# EasyEDA Pro project 宠物喂食机-V2.eprj

# Schematic Schematic1
Create Date: 2023-04-19; Page Name: P1; Project Name: 宠物喂食机-V2; Schematic Name: Schematic1; Update Date: 2023-05-22; Company: 嘉立创EDA; Page Size: A4; Version: V1.0
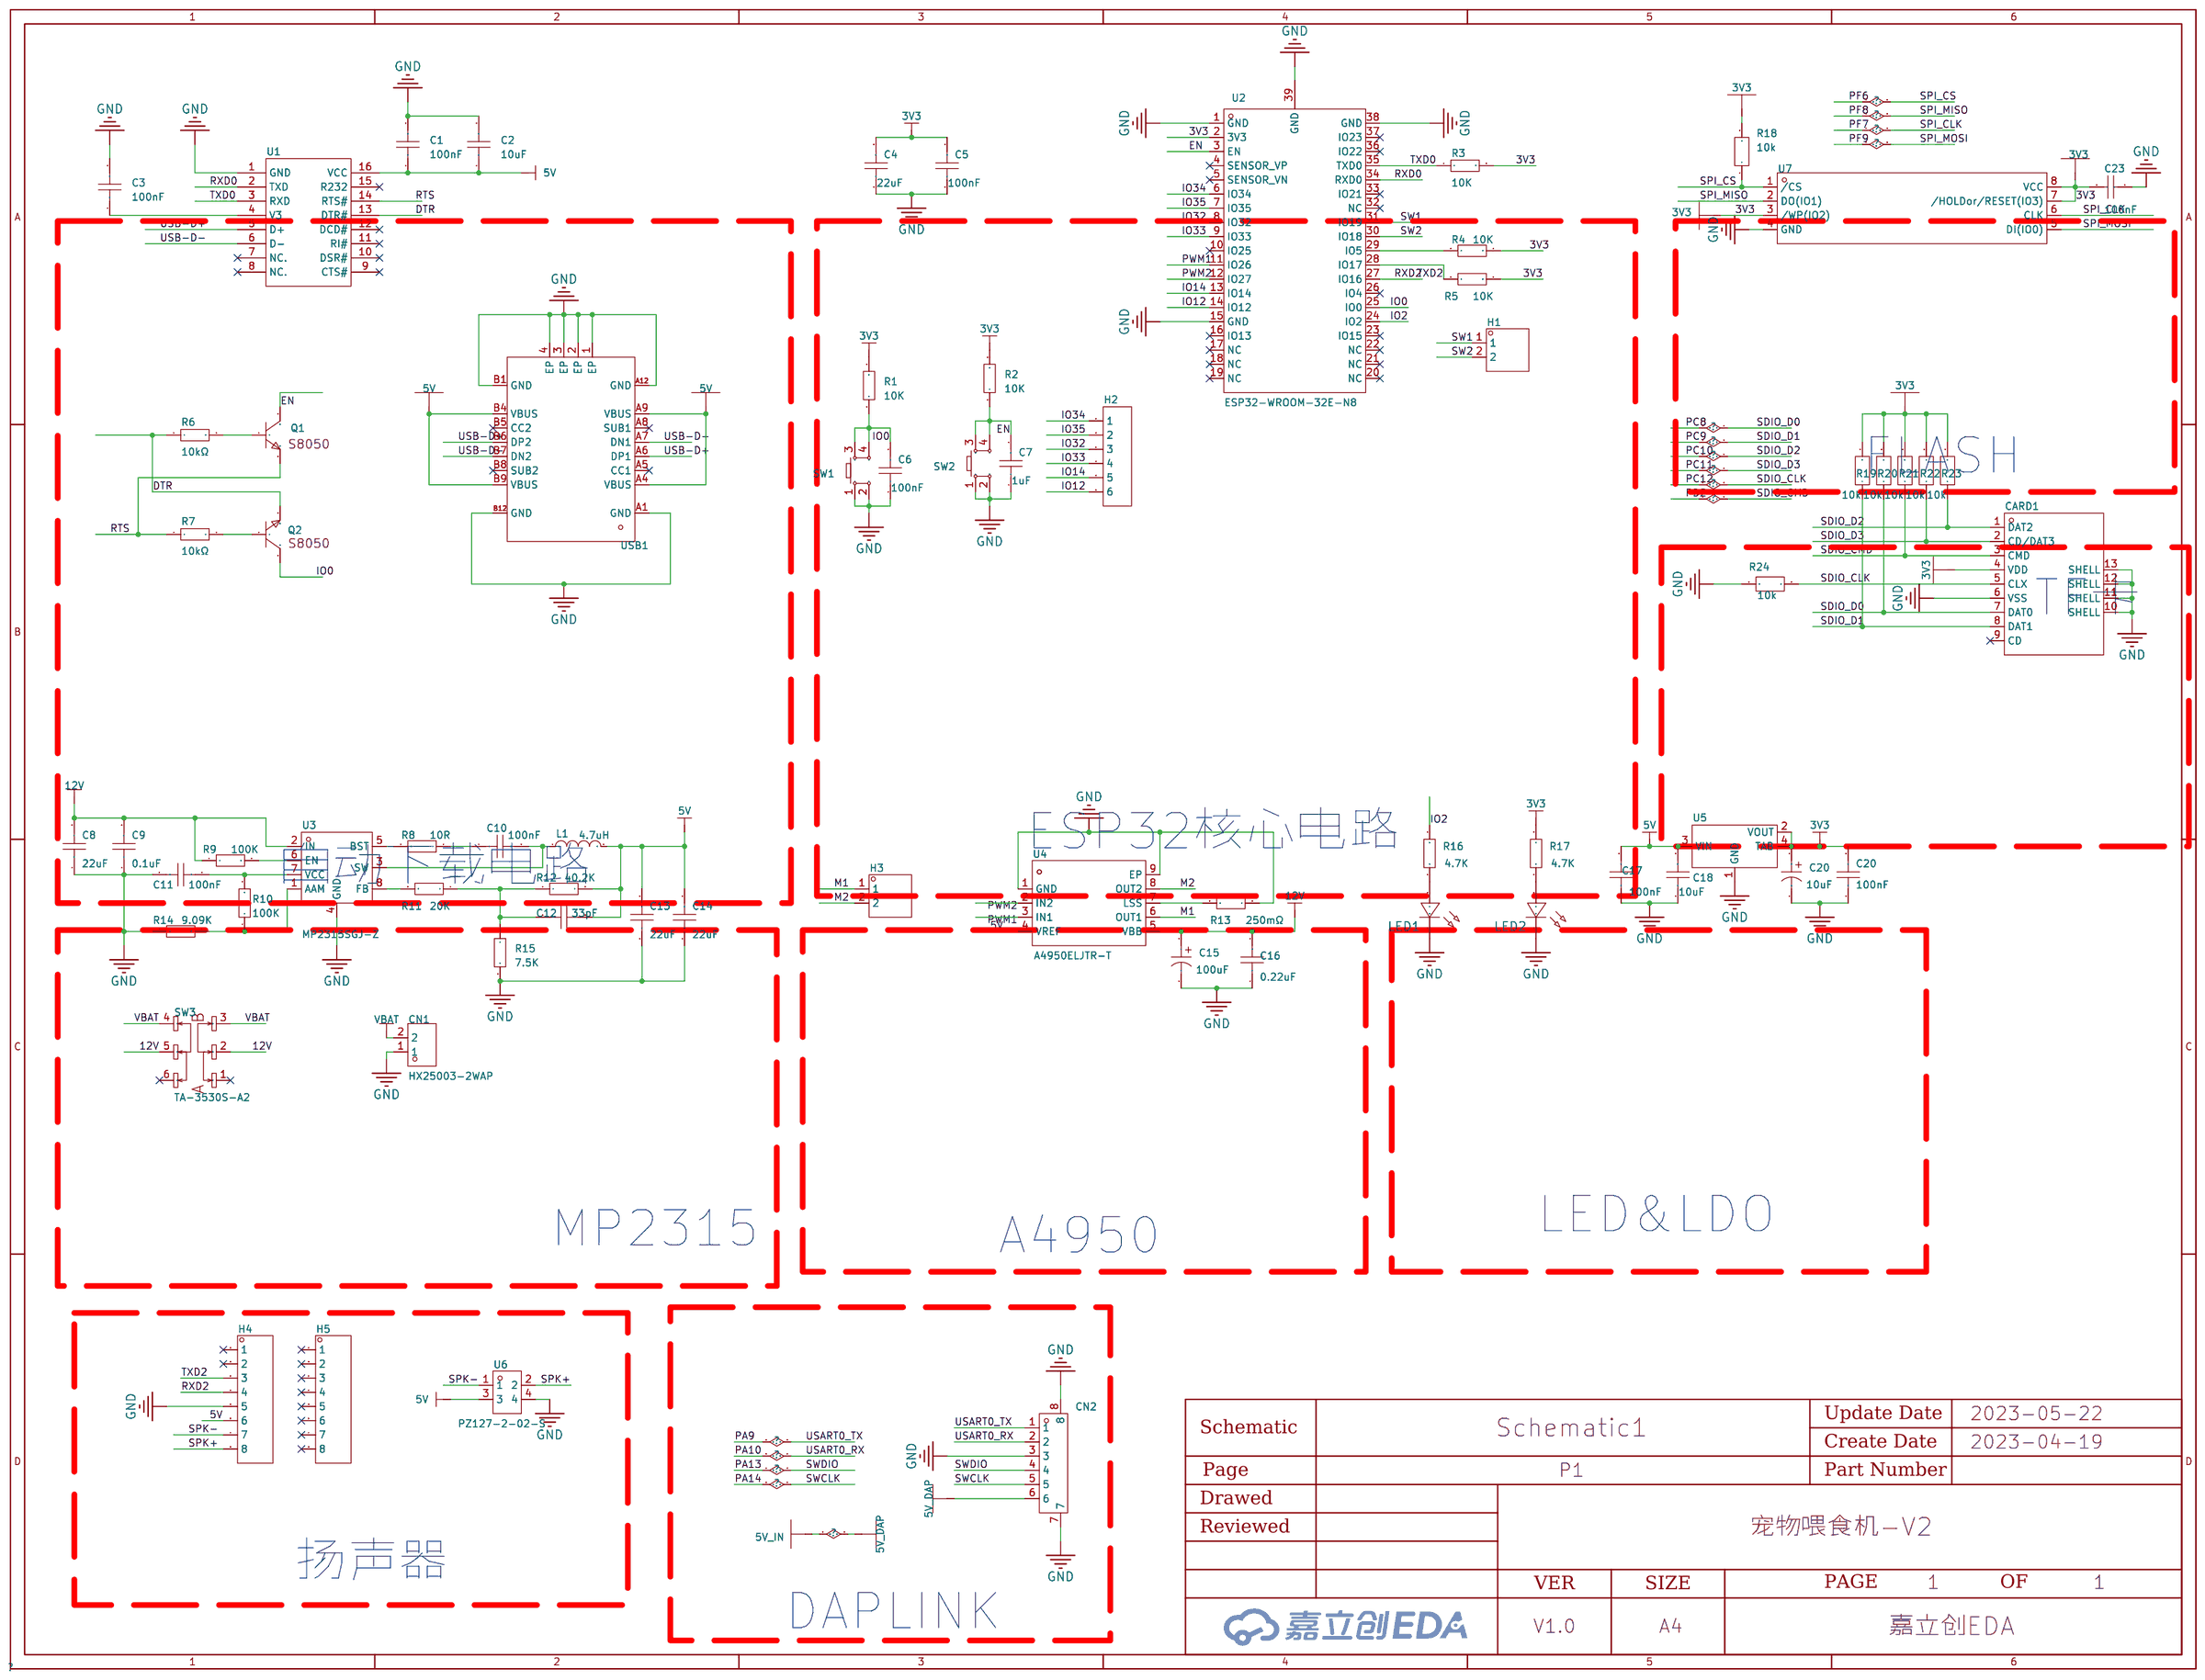
[diagram p0: schematic sheet]

## Parts
C1  100nF  [C0603]
C2  10uF  [C0603]
C3  100nF  [C0603]
C4  22uF  [C0603]
C5  100nF  [C0603]
C6  100nF  [C0603]
C7  1uF  [C0603]
C8  22uF  [C1206]
C9  0.1uF  [C0805]
C10  100nF  [C0603]
C11  100nF  [C0603]
C12  33pF  [C0603]
C13  22uF  [C0805]
C14  22uF  [C0805]
C15  100uF  [CAP-SMD_BD8.0-L8.3-W8.3-FD]
C16  0.22uF  [C0603_2]
C17  100nF  [C0603_1]
C18  10uF  [C0603_1]
C20  100nF  [C0603_1]
C20#2  10uF  [CAP-SMD_L3.2-W1.6-FD]
C23  100nF  [r0402_1]
CARD1  -  [tf-smd_thd2528-11sd-gf_1]
CN1  HX25003-2WAP  [CONN-TH_2P-P2.50_HX25003-2WAP]
CN2  -  [CONN-SMD_6P-P1.00_XUNPU_WAFER-100W-6P]
H1  -  [HDR-TH_2P-P2.54-V-M-1]
H2  -  [HDR-TH_6P-P2.54-V-M-1]
H3  -  [HDR-TH_2P-P2.54-V-M-1]
H4  -  [HDR-TH_8P-P2.54-V-M]
H5  -  [HDR-TH_8P-P2.54-V-M]
L1  4.7uH  [IND-SMD_L7.3-W6.6]
LED1  -  [LED_0603]
LED2  -  [LED_0603]
Q1  -  [S8050_SOT-23]
Q2  -  [S8050_SOT-23]
R1  10K  [R0603]
R2  10K  [R0603]
R3  10K  [R0603_1]
R4  10K  [R0603]
R5  10K  [R0603_1]
R6  10kΩ  [R0603]
R7  10kΩ  [R0603]
R8  10R  [R0603]
R9  100K  [R0603]
R10  100K  [R0603]
R11  20K  [R0603]
R12  40.2K  [R0603]
R13  250mΩ  [R2512]
R14  9.09K  [R0603]
R15  7.5K  [R0603]
R16  4.7K  [R0603]
R17  4.7K  [R0603]
R18  10k  [R0402]
R19  10k  [R0402]
R20  10k  [R0402]
R21  10k  [R0402]
R22  10k  [R0402]
R23  10k  [R0402]
R24  10k  [R0402]
SW1  -  [KEY-SMD_4P-L4.5-W4.5-P3.00-LS6.8]
SW2  -  [KEY-SMD_4P-L4.5-W4.5-P3.00-LS6.8]
SW3  TA-3530S-A2  [SW-SMD_6P-L9.1-W3.5-P2.50-LS6.9]
U1  CH340C  [SOP-16_L10.0-W3.9-P1.27-LS6.0-BL]
U2  ESP32-WROOM-32E-N8  [WIFI-SMD_ESP32-WROOM-32E_1]
U3  MP2315SGJ-Z  [TSOT-23-8_L2.9-W1.6-P0.65-LS2.8-BL]
U4  A4950ELJTR-T  [SOIC-8_L4.9-W3.9-P1.27-LS6.0-BL-EP]
U5  -  [SOT_224]
U6  PZ127-2-02-S  [HDR-SMD_4P-P1.27-V-M-R2-C2-LS5.3]
U7  -  [SOIC-8_L5.2-W5.2-P1.27-LS7.9-BL]
USB1  -  [USB-C-SMD_KH-TYPE-C-16P_1]

## Library data of the parts
C1-C7 = CAP_0805: Supplier Footprint: 0805
C8 = CAP_1206: Supplier Footprint: 1206
C9 C10 C12-C14 = CAP_0603: Supplier Footprint: 0603
C11 = CL05B104KO5NNNC: 容值:100nF;精度:±10%;额定电压:16V;材质(温度系数):X7R;; LCSC Part Name: 100nF ±10% 16V; Supplier Part: C1525; Manufacturer: SAMSUNG(三星); Supplier Footprint: 0402; JLCPCB Part Class: Basic Part; Datasheet: https://atta.szlcsc.com/upload/public/pdf/source/20160103/1457707674891.pdf; Supplier: LCSC; Tolerance: ±10%; Voltage Rated: 16V; Temperature Coefficient: X7R
C15 = 50SGV100M8X10.5: 容值:100uF;额定电压:50V;纹波电流:-;等效串联电阻:-;; LCSC Part Name: 100uF 50V; Supplier Part: C700843; Manufacturer: rubycon(红宝石); Supplier Footprint: SMD,D8xL10.5mm; JLCPCB Part Class: Extended Part; Datasheet: https://atta.szlcsc.com/upload/public/pdf/source/20200710/C700843_0FD27FFFAAC5BA0F9ED055A6AD937E84.pdf; Supplier: LCSC; Rated Voltage: 50V
C16 = CAP_605: Supplier Footprint: 0603
C17 C18 C20 = CAP_604: Supplier Footprint: 0603; Check: true
C20#2 = T494A106K016AT: 容值:10uF;精度:±10%;额定电压:16V;等效串联电阻:3Ω;; LCSC Part Name: 10uF ±10% 16V; Supplier Part: C1952724; Manufacturer: KEMET(基美); Supplier Footprint: 1206; JLCPCB Part Class: Extended Part; Datasheet: https://atta.szlcsc.com/upload/public/pdf/source/20201117/C918865_2EC2324DB0DED54D3EF2ACC81798626D.pdf; Supplier: LCSC; Tolerance: ±10%; Rated Voltage: 16V; Equivalent Series Resistance(ESR): 3Ω; Operating Temperature: -55℃~+125℃
C23 = CC0402KRX7R9BB104: 容值:100nF;精度:±10%;额定电压:50V;温度系数:X7R;; LCSC Part Name: 100nF ±10% 50V; Supplier Part: C131394; Manufacturer: YAGEO(国巨); Supplier Footprint: 0402; JLCPCB Part Class: Extended Part; Datasheet: https://atta.szlcsc.com/upload/public/pdf/source/20170925/C131394_1506321459057990237.pdf; Supplier: LCSC; Tolerance: ±10%; Voltage Rated: 50V; Temperature Coefficient: X7R
CARD1 = thd2528-11sd-gf_2: 卡连接方式:自弹式;卡类型:MicroSD卡(TF卡);连接器类型:卡座;本体最大高度:2mm;工作温度范围:-;; LCSC Part Name: 自弹式 MicroSD卡(TF卡) 卡座 外焊; Supplier Part: C283232; Manufacturer: THD(台华达); Manufacturer Part: THD2528-11SD-GF; Supplier Footprint: SMD; JLCPCB Part Class: Extended Part; Datasheet: https://atta.szlcsc.com/upload/public/pdf/source/20190329/C283232_532F94C79FB51CC42613BF324E8B5690.pdf; Supplier: LCSC; Card Connection Mode: 自弹式; Card Type: MicroSD卡(TF卡); Connector Type: 卡座; Maximum Body Height: 2mm
CN1 = HX25003-2WAP: 参考系列:XH;间距:2.5mm;插针结构:1x2P;排数:1;每排PIN数:2;行距:-;公母:公型插针;安装方式:弯插;额定电流:-;工作温度范围:-;; LCSC Part Name: XH 2.5mm 1x2P 弯插 母座; Supplier Part: C442326; Manufacturer: HX(红星); Supplier Footprint: 插件,P=2.5mm; JLCPCB Part Class: Extended Part; Datasheet: https://atta.szlcsc.com/upload/public/pdf/source/20191028/C442326_951D1FF48F4BC139C99E649B2A876D28.pdf; Supplier: LCSC; Reference Series: XH; Pitch: 2.5mm; Pins Structure: 1x2P; Number of Rows: 1; Number of PINs Per Row: 2; Gender: 公型插针; Mounting Style: 弯插
CN2 = WAFER-100W-6A_2: 参考系列:-;间距:1mm;插针结构:1x6P;排数:1;每排PIN数:6;行距:-;公母:公型插针;安装方式:卧贴;额定电流:1A;工作温度范围:-25~+70;; LCSC Part Name: 6P 间距1mm; Supplier Part: C2874473; Manufacturer: 台湾汉博; Manufacturer Part: WAFER-100W-6A; Supplier Footprint: SMD,P=1mm; JLCPCB Part Class: Extended Part; Datasheet: https://atta.szlcsc.com/upload/public/pdf/source/20210913/6ECD69B22B5A03895C8AEF8BA0F72319.pdf; Supplier: LCSC; Pitch: 1mm; Pins Structure: 1x6P; Number of Rows: 1; Number of PINs Per Row: 6; Gender: 公型插针; Mounting Style: 卧贴; Current Rating (Max): 1A; Operating Temperature Range: -25~+70
H1 H3 = HDR-M_2.54_1x2P: Supplier Part: C124375; Supplier Footprint: 插件
H2 = HDR-M_2.54_1x6P: Supplier Part: C37208; Supplier Footprint: 插件
H4 H5 = HDR-M_2.54_1x8P: Supplier Part: C124381; Supplier Footprint: 插件
L1 = MCS0630-4R7MPY1: 电感值:4.7uH;精度:±20%;额定电流:5.5A;饱和电流(Isat):7A;; LCSC Part Name: 4.7uH ±20% 5.5A 37mΩ; Supplier Part: C2937097; Manufacturer: PSA(信昌电陶); Supplier Footprint: 0630; JLCPCB Part Class: Extended Part; Datasheet: https://atta.szlcsc.com/upload/public/pdf/source/20220121/EA6E6E6F70ED7BAE67EC293805EAAACB.pdf; Supplier: LCSC; Tolerance: ±20%; Rated Current: 5.5A; Saturation Current (Isat): 7A; DC Resistance (DCR): 37mΩ
LED1 LED2 = LED_0603-R: Supplier Footprint: 0603; Check: true
Q1 Q2 = S8050_SOT_NPN: Supplier Footprint: SOT-23; Manufacturer Part: S8050
R1 R2 R4 R8-R12 R14-R17 = Res_0603: Supplier Footprint: 0603; Check: true
R3 R5 = Res_604: Supplier Footprint: 0603
R6 R7 = 0402WGF1202TCE: 电阻类型:厚膜电阻;阻值:12kΩ;精度:±1%;功率:62.5mW;温度系数:±100ppm/℃;最大工作电压:50V;工作温度范围:-55℃~+155℃;; LCSC Part Name: 12kΩ ±1% 62.5mW; Supplier Part: C25752; Manufacturer: UNI-ROYAL(厚声); Supplier Footprint: 0402; JLCPCB Part Class: Basic Part; Datasheet: https://atta.szlcsc.com/upload/public/pdf/source/20200306/C422600_1E6D84923E4A46A82E41ADD87F860B5C.pdf; Supplier: LCSC; Type: 厚膜电阻; Tolerance: ±1%; Power(Watts): 62.5mW; Temperature Coefficient: ±100ppm/℃; Overload Voltage (Max): 50V; Operating Temperature Range: -55℃~+155℃
R13 = 25121WF250LT4E: 电阻类型:厚膜电阻;阻值:250mΩ;精度:±1%;功率:1W;; LCSC Part Name: 250mΩ ±1% 1W; Supplier Part: C25467; Manufacturer: UNI-ROYAL(厚声); Supplier Footprint: 2512; JLCPCB Part Class: Extended Part; Datasheet: https://atta.szlcsc.com/upload/public/pdf/source/20200306/C422600_1E6D84923E4A46A82E41ADD87F860B5C.pdf; Supplier: LCSC; Type: 厚膜电阻; Tolerance: ±1%; Power(Watts): 1W; Temperature Coefficient: ±800ppm/℃; Overload Voltage (Max): 200V; Operating Temperature Range: -55℃~+155℃
R18-R24 = 040200j0103tce_1: 阻值:10k;精度:±5%;功率:-;温度系数:-;最大工作电压:50V;工作温度范围:-55~+155;; LCSC Part Name: 10k ±5%; Supplier Part: C301923; Manufacturer: UNI-ROYAL(厚声); Manufacturer Part: 040200J0103TCE; Supplier Footprint: 0402; JLCPCB Part Class: Extended Part; Datasheet: https://atta.szlcsc.com/upload/public/pdf/source/20181030/C301923_6E0C743A136A530FB407F45522E174A0.pdf; Supplier: LCSC; Tolerance: ±5%; Overload Voltage (Max): 50V; Operating Temperature Range: -55~+155
SW1 SW2 = Key_SMD_12x12x7.3: Supplier Footprint: SMD
SW3 = TA-3530S-A2: LCSC Part Name: 滑动开关9.1*3.5*3.0mm贴片正拨六脚二档; Supplier Part: C514028; Manufacturer: Yuandi(元迪); Supplier Footprint: SMD,9.1x3.5mm; JLCPCB Part Class: Extended Part; Datasheet: https://atta.szlcsc.com/upload/public/pdf/source/20191028/C441715_A405F7167E7005DDDB9DACD46ECCDAD7.pdf; Supplier: LCSC
U1 = CH340C: 类型:Transceiver;协议类别:USB 2.0;驱动器/接收器数:-;数据速率:2Mbps;; Supplier Part: C84681; Manufacturer: WCH(南京沁恒); Supplier Footprint: SOP-16_150mil; JLCPCB Part Class: 扩展库; Datasheet: https://atta.szlcsc.com/upload/public/pdf/source/20200819/C84681_ADBED554CE321879DBD6B1D06488689C.pdf; Supplier: LCSC; Type: Transceiver; Protocol: USB 2.0; Data Rate: 2Mbps; Supply Voltage: 3.3V, 5V
U2 = ESP32-WROOM-32E-N8_C701342_1: ESP32-WROOM-32E 集成 ESP32-D0WD-V3 芯片，具有?高的稳定性和安全性能。; LCSC Part Name: 通用型Wi-Fi+BT+BLE的MCU模组 PCB板载天线模组; Supplier Part: C701342; Manufacturer: ESPRESSIF(乐鑫); Supplier Footprint: SMD,18x25.5mm; JLCPCB Part Class: Extended Part; Datasheet: https://atta.szlcsc.com/upload/public/pdf/source/20200730/C701341_95E089979D39CD8D2471FDC7C7AF29A1.pdf; Supplier: LCSC
U3 = MP2315SGJ-Z: Supplier Part: C3031493; Supplier Footprint: TSOT23-8; JLCPCB Part Class: Extended Part; Datasheet: https://atta.szlcsc.comnull; Supplier: LCSC
U4 = A4950ELJTR-T: 全桥DMOS PWM电机驱动器; Supplier Part: C82404; Manufacturer: ALLEGRO(美国埃戈罗); Supplier Footprint: SOIC-8-EP; JLCPCB Part Class: Extended Part; Datasheet: https://atta.szlcsc.com/upload/public/pdf/source/20161024/1477288450284.pdf; Supplier: LCSC
U5 = AMS1117_1: Supplier Footprint: SOT_223; Check: true
U6 = PZ127-2-02-S: 间距：1.27mm 总孔位数：4 排数：2 插孔结构：2x2P 安装类型：立贴 圆孔/方孔：方孔 额定电流：1A; LCSC Part Name: 1.27mm 2*2贴片排针; Supplier Part: C3975185; Manufacturer: HCTL(华灿天禄); Supplier Footprint: SMD,P=1.27mm; JLCPCB Part Class: Extended Part; Datasheet: https://atta.szlcsc.com/upload/public/pdf/source/20220711/C6FD20150756CB9D4476A8239DD5A327.pdf; Supplier: LCSC
U7 = w25q128jvsim_1: LCSC Part Name: W25Q128JVSIM; Supplier Part: C2613930; Manufacturer: WINBOND(华邦); Manufacturer Part: W25Q128JVSIM; LCSC Stock: 0; LCSC On Sale: 1; Supplier Footprint: SOIC-8; Price: 10.59; JLCPCB Part Class: Extended Part; JLCPCB Stock: 0; JLCPCB On Sale: 1; Datasheet: https://atta.szlcsc.com/upload/public/pdf/source/20210412/84C68860639CE6E99E4DBE9DB39E5296.pdf; Supplier: LCSC
USB1 = kh-type-c-16p_2: Type-C母座 16PIN 立式四角贴板无压片; LCSC Part Name: Type-C母座; Supplier Part: C709357; Manufacturer: kinghelm(金航标); Manufacturer Part: KH-TYPE-C-16P; LCSC Stock: 5637; LCSC On Sale: 1; Price: 0.484; JLCPCB Part Class: Extended Part; JLCPCB Stock: 2220; JLCPCB On Sale: 1; Datasheet: https://atta.szlcsc.com/upload/public/pdf/source/20200911/C709357_AA8DCEB38BB20E3035A7ED7AE7667837.pdf; Supplier: LCSC; Check: true

## Nets
3V3: C4.2 C5.2 C20.2 C20#2.1 C23.1 CARD1.4(VDD) R1.2 R2.2 R3.2 R4.1 R5.2 R17.2 R18.2 R19.2 R20.2 R21.2 R22.2 R23.2 U2.2(3V3) U5.2(VOUT) U5.4(TAB) U7.3(/WP(IO2)) U7.7(/HOLDor/RESET(IO3)) U7.8(VCC)
5V: C1.1 C2.1 C12.2 C13.2 C14.2 C17.2 C18.2 H4.6 L1.2 R12.2 U1.16(VCC) U4.4(VREF) U5.3(VIN) U6.3 USB1.A4(VBUS) USB1.A9(VBUS) USB1.B4(VBUS) USB1.B9(VBUS)
5V_DAP: CN2.6
12V: C8.2 C9.2 C15.1 C16.2 R9.1 SW3.2 SW3.5 U3.2(IN) U4.5(VBB)
GND: C1.2 C2.2 C3.2 C4.1 C5.1 C6.1 C7.1 C8.1 C9.1 C11.2 C13.1 C14.1 C15.2 C16.1 C17.1 C18.1 C20.1 C20#2.2 C23.2 CARD1.6(VSS) CARD1.10(SHELL) CARD1.11(SHELL) CARD1.12(SHELL) CARD1.13(SHELL) CN1.1 CN2.3 CN2.7 CN2.8 H4.5 LED1.1(C) LED2.1(C) R13.2 R14.1 R15.2 R24.2 SW1.1 SW1.2 SW2.1 SW2.2 U1.1(GND) U2.1(GND) U2.15(GND) U2.38(GND) U2.39(GND) U3.4(GND) U4.1(GND) U4.9(EP) U5.1(GND) U6.4 U7.4(GND) USB1.1(EP) USB1.2(EP) USB1.3(EP) USB1.4(EP) USB1.A1(GND) USB1.A12(GND) USB1.B1(GND) USB1.B12(GND)
VBAT: CN1.2 SW3.3 SW3.4
DTR: Q2.2 R6.1 U1.13(DTR#)
EN: C7.2 Q1.3 R2.1 SW2.3 SW2.4 U2.3(EN)
IO0: C6.2 Q2.3 R1.1 SW1.3 SW1.4 U2.25(IO0)
IO2: R16.2 U2.24(IO2)
IO12: H2.6 U2.14(IO12)
IO14: H2.5 U2.13(IO14)
IO32: H2.3 U2.8(IO32)
IO33: H2.4 U2.9(IO33)
IO34: H2.1 U2.6(IO34)
IO35: H2.2 U2.7(IO35)
M1: H3.1 U4.6(OUT1)
M2: H3.2 U4.8(OUT2)
PA9: CN2.1
PA10: CN2.2
PA13: CN2.4
PA14: CN2.5
PC8: CARD1.7(DAT0) R20.1
PC9: CARD1.8(DAT1) R19.1
PC10: CARD1.1(DAT2) R23.1
PC11: CARD1.2(CD/DAT3) R22.1
PC12: CARD1.5(CLX) R24.1
PD2: CARD1.3(CMD) R21.1
PF6: R18.1 U7.1(/CS)
PF7: U7.6(CLK)
PF8: U7.2(DO(IO1))
PF9: U7.5(DI(IO0))
PWM1: U2.11(IO26) U4.3(IN1)
PWM2: U2.12(IO27) U4.2(IN2)
RTS: Q1.2 R7.1 U1.14(RTS#)
RXD0: U1.2(TXD) U2.34(RXD0)
RXD2: H4.4 U2.27(IO16)
SPK+: H4.8 U6.2
SPK-: H4.7 U6.1
SW1: H1.1 U2.31(IO19)
SW2: H1.2 U2.30(IO18)
TXD0: R3.1 U1.3(RXD) U2.35(TXD0)
TXD2: H4.3 R5.1 U2.28(IO17)
USB-D+: U1.5(D+) USB1.A6(DP1) USB1.B6(DP2)
USB-D-: U1.6(D-) USB1.A7(DN1) USB1.B7(DN2)
$C3_1: C3.1 U1.4(V3)
$C10_1: C10.1 R8.1
$C10_2: C10.2 L1.1 U3.3(SW)
$C11_1: C11.1 R10.2 U3.7(VCC)
$C12_1: C12.1 R11.1 R12.1 R15.1
$LED1_2: LED1.2(A) R16.1
$LED2_2: LED2.2(A) R17.1
$Q1_1: Q1.1 R6.2
$Q2_1: Q2.1 R7.2
$R4_2: R4.2 U2.29(IO5)
$R8_2: R8.2 U3.5(BST)
$R9_2: R9.2 U3.6(EN)
$R10_1: R10.1 R14.2 U3.1(AAM)
$R11_2: R11.2 U3.8(FB)
$R13_1: R13.1 U4.7(LSS)

Not connected (* = marked no-connect by the designer): CARD1 9(CD)*; H4 1* 2*; H5 1* 2* 3* 4* 5* 6* 7* 8*; SW3 1* 6*; U1 7(NC.)* 8(NC.)* 9(CTS#)* 10(DSR#)* 11(RI#)* 12(DCD#)* 15(R232)*; U2 4(SENSOR_VP)* 5(SENSOR_VN)* 10(IO25)* 16(IO13)* 17(NC)* 18(NC)* 19(NC)* 20(NC)* 21(NC)* 22(NC)* 23(IO15)* 26(IO4)* 32(NC)* 33(IO21)* 36(IO22)* 37(IO23)*; USB1 A5(CC1)* A8(SUB1)* B5(CC2)* B8(SUB2)*

## Notes on the sheet
- FLASH
- TF卡
- ESP32核心电路
- 自动下载电路
- LED&LDO
- MP2315
- A4950
- 扬声器
- DAPLINK

# Board PCB1
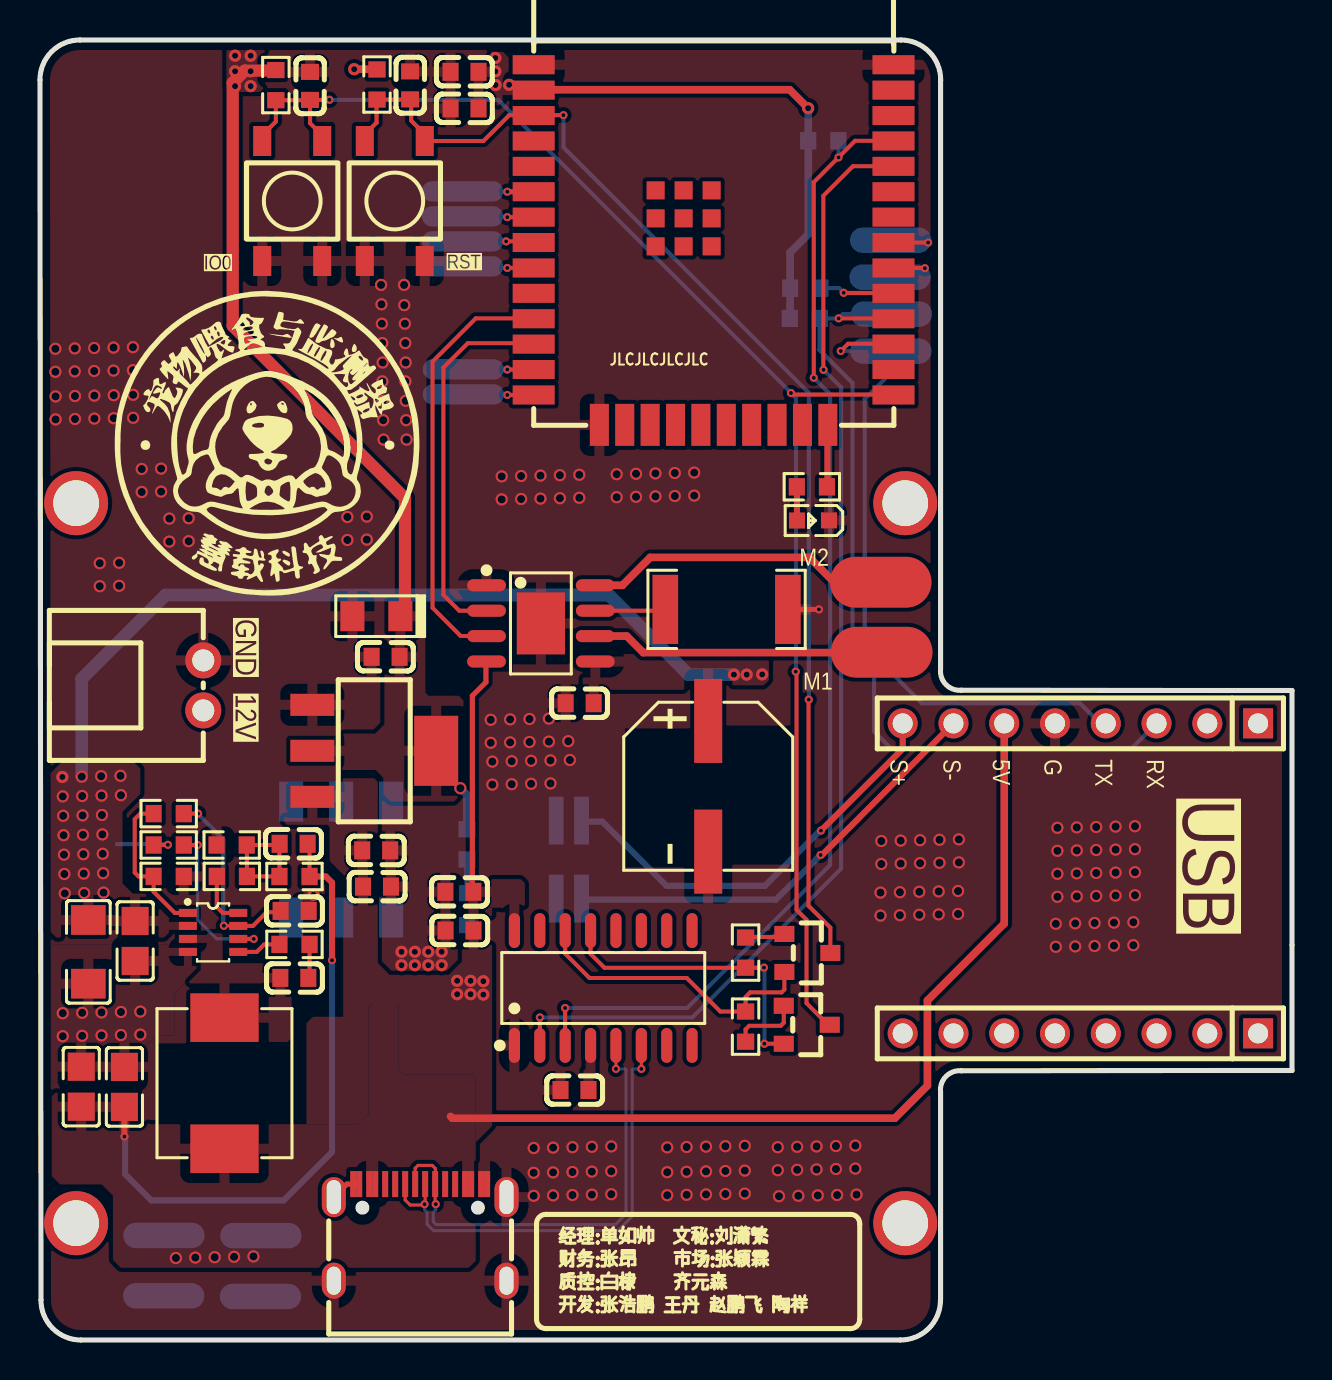
[diagram p1: board, top side]
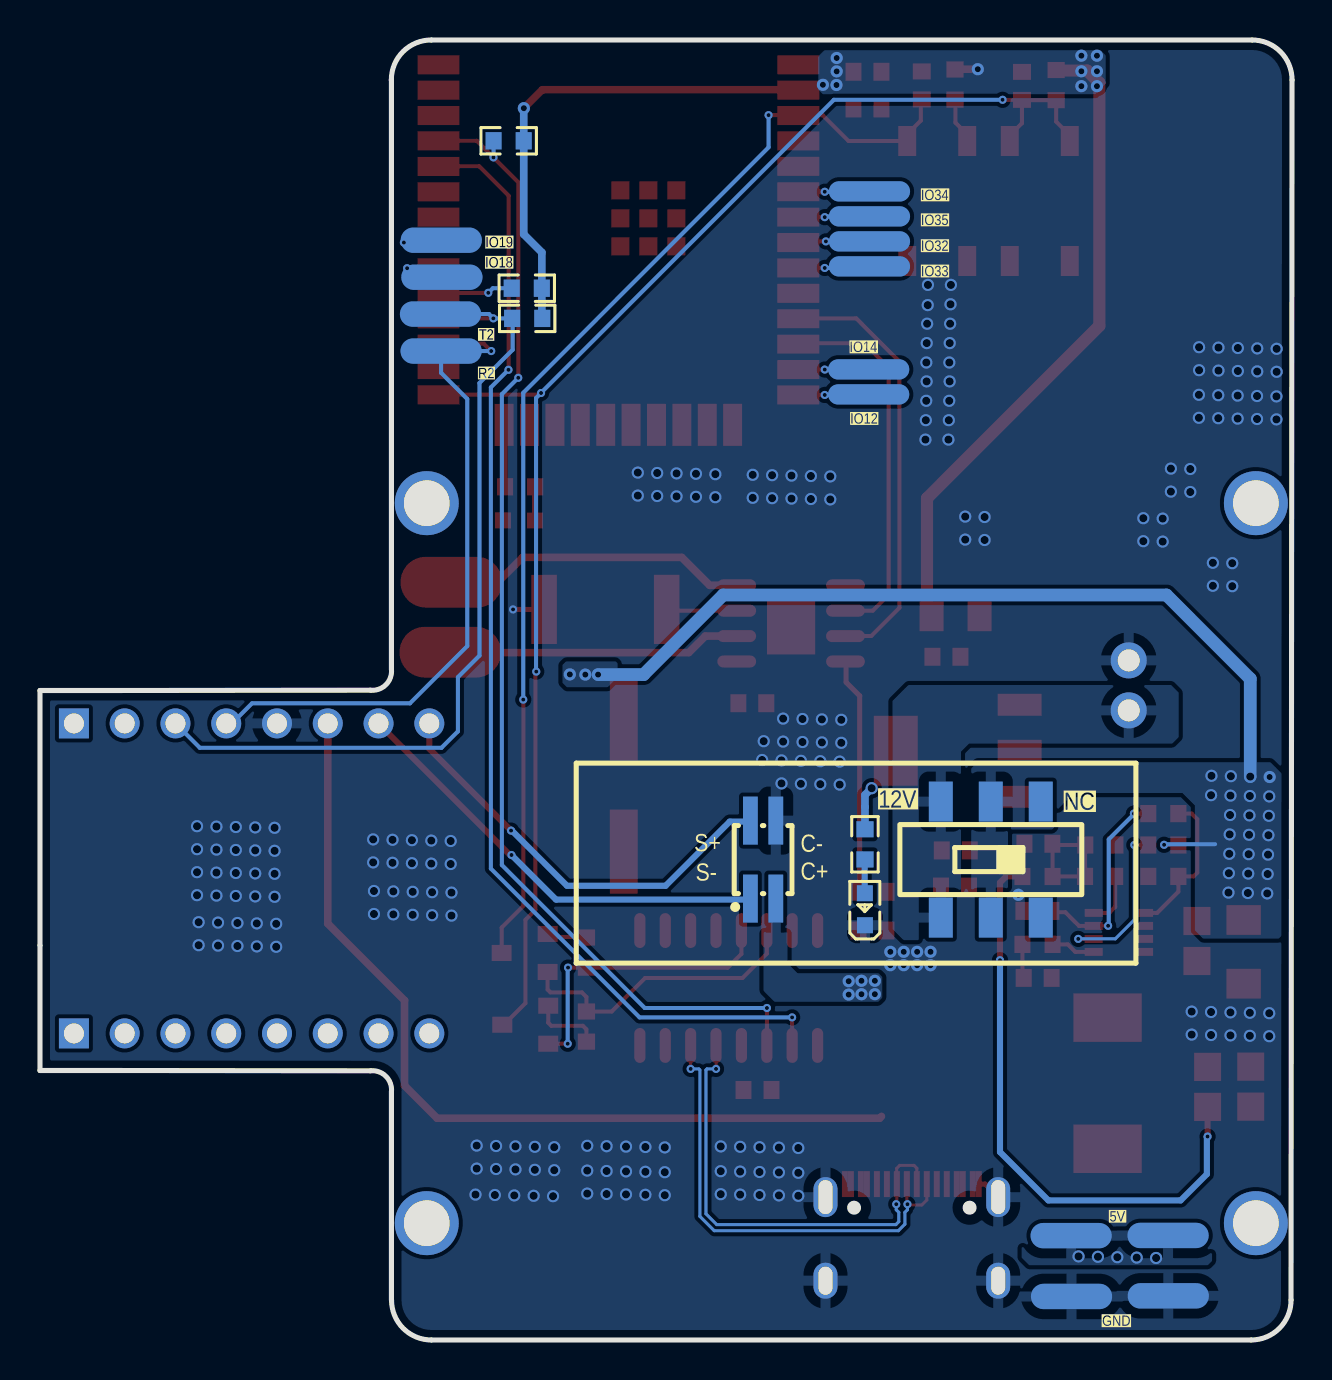
[diagram p2: board, bottom side, seen from below]

Outline 62.64 x 65 mm; copper layers: Top Layer, Bottom Layer. Coordinates in mm from the lower left corner of the outline.
Outline path: 0,63 arc(0.58,64.42) 2,65 43.06,65 arc(44.48,64.42) 45.06,63 45.06,63 45.06,33.54 arc(45.33,32.77) 46.1,32.49 58.76,32.47 62.64,32.47 62.64,13.47 58.76,13.47 46.1,13.46 arc(45.33,13.18) 45.06,12.41 45.06,2 45.05,2 arc(44.47,0.58) 43.05,0 2.05,0 arc(0.63,0.58) 0.05,2 0,63
Stack: Top Layer 0.035mm / Dielectric1 1.51mm FR4 er 4.5 / Bottom Layer 0.035mm

## Design rules (mm)
net VBAT: PWR
net 12V: PWR
net GND: PWR
net 5V: PWR
net USB-D-: DP1
net USB-D+: DP1
net 3V3: PWR
spacing safeClearance (default): track to track 0.152, other pairs 0.152 to 0.508
track width trackWidth (default): min 0.127, default 0.254, max 2.54
differential pair differentialPair (default): width min 0.127, default 0.254, max 2.54; gap min 0.152, default 0.152
via viaSize (default): diameter min 0.406, default 0.61, max 10; hole min 0.203, default 0.305, max 5.999

## Placement (name value [footprint] x y rotation side)
C1  100nF  [C0603]  20.99 20.47 180 top
C2  10uF  [C0603]  20.98 22.41 180 top
C3  100nF  [C0603]  26.74 12.5 180 top
C4  22uF  [C0603]  21.24 61.58 0 top
C5  100nF  [C0603]  21.24 63.41 0 top
C6  100nF  [C0603]  13.51 62.71 270 top
C7  1uF  [C0603]  18.52 62.73 270 top
C8  22uF  [C1206]  2.42 19.41 90 top
C9  0.1uF  [C0805]  4.76 19.95 90 top
C10  100nF  [C0603]  12.72 18.11 180 top
C11  100nF  [C0603]  12.74 21.45 0 top
C12  33pF  [C0603]  12.69 24.81 0 top
C13  22uF  [C0805]  4.23 12.66 270 top
C14  22uF  [C0805]  2.07 12.67 270 top
C15  100uF  [CAP-SMD_BD8.0-L8.3-W8.3-FD]  33.43 27.69 270 top
C16  0.22uF  [C0603_2]  27 31.84 0 top
C17  100nF  [C0603_1]  16.86 22.67 180 top
C18  10uF  [C0603_1]  16.82 24.48 180 top
C19  10uF  [CAP-SMD_L3.2-W1.6-FD]  16.83 36.19 180 top
C20  100nF  [C0603_1]  17.29 34.16 0 top
CN1  HX25003-2WAP  [CONN-TH_2P-P2.50_HX25003-2WAP]  8.17 32.73 270 top
H4  -  [HDR-TH_8P-P2.54-V-M]  52.05 30.83 180 top
H5  -  [HDR-TH_8P-P2.54-V-M]  52.05 15.33 180 top
L1  4.7uH  [IND-SMD_L7.3-W6.6]  9.23 12.84 90 top
LED1  -  [LED_0603]  38.62 40.97 180 top
LED2  -  [LED_0603]  21.38 21.59 90 bottom
NOREF  -  [Pad_e223]  11.03 2.18 0 top
NOREF#2  -  [Pad_e69]  42.53 53.14 0 top
NOREF#3  -  [Pad_e3]  43.29 5.84 90 top
NOREF#4  -  [Pad_e312]  21.18 47.28 0 top
NOREF#5  -  [Pad_e5]  43.29 41.84 90 top
NOREF#6  -  [Pad_e310]  21.14 53.68 0 top
NOREF#7  -  [Pad_e222]  6.19 2.21 0 top
NOREF#8  -  [Pad_e308]  21.14 56.18 0 top
NOREF#9  -  [Pad_e4]  1.81 41.84 90 top
NOREF#10  -  [Pad_e2]  1.81 5.84 90 top
NOREF#11  -  [Pad_e72]  42.6 51.3 0 top
NOREF#12  -  [Pad_e1]  42.06 37.89 0 top
NOREF#13  -  [Pad_e221]  11.05 5.22 0 top
NOREF#14  -  [Pad_e309]  21.14 54.93 0 top
NOREF#15  -  [Pad_e68]  42.56 54.99 0 top
NOREF#16  -  [Pad_e311]  21.18 48.53 0 top
NOREF#17  -  [Pad_e220]  6.2 5.23 0 top
NOREF#18  -  [Pad_e307]  21.14 57.43 0 top
NOREF#19  -  [Pad_e17]  42.11 34.39 0 top
NOREF#20  -  [Pad_e70]  42.57 49.45 0 top
Q1  -  [S8050_SOT-23]  38.39 19.48 180 top
Q2  -  [S8050_SOT-23]  38.36 15.89 180 top
R1  10K  [R0603]  11.8 62.74 90 top
R2  10K  [R0603]  16.86 62.77 90 top
R3  10K  [R0603_1]  39.19 59.96 180 bottom
R4  10K  [R0603]  38.28 52.59 0 bottom
R5  10K  [R0603_1]  38.26 51.08 180 bottom
R6  10kΩ  [R0603]  35.3 19.37 90 top
R7  10kΩ  [R0603]  35.3 15.67 270 top
R8  10R  [R0603]  12.73 19.78 180 top
R9  100K  [R0603]  6.44 24.75 0 top
R10  100K  [R0603]  6.44 26.32 0 top
R11  20K  [R0603]  9.6 23.18 180 top
R12  40.2K  [R0603]  12.73 23.17 0 top
R13  250mΩ  [R2512]  34.35 36.53 0 top
R14  9.09K  [R0603]  6.44 23.18 180 top
R15  7.5K  [R0603]  9.59 24.75 180 top
R16  4.7K  [R0603]  38.62 42.66 0 top
R17  4.7K  [R0603]  21.37 24.78 90 bottom
SW1  -  [KEY-SMD_4P-L4.5-W4.5-P3.00-LS6.8]  12.62 56.95 90 top
SW2  -  [KEY-SMD_4P-L4.5-W4.5-P3.00-LS6.8]  17.75 56.95 90 top
SW3  TA-3530S-A2  [SW-SMD_6P-L9.1-W3.5-P2.50-LS6.9]  15.07 24.02 0 bottom
U1  CH340C  [SOP-16_L10.0-W3.9-P1.27-LS6.0-BL]  28.18 17.6 0 top
U2  ESP32-WROOM-32E-N8  [WIFI-SMD_ESP32-WROOM-32E_1]  33.7 54.76 270 top
U3  MP2315SGJ-Z  [TSOT-23-8_L2.9-W1.6-P0.65-LS2.8-BL]  8.66 20.38 270 top
U4  A4950ELJTR-T  [SOIC-8_L4.9-W3.9-P1.27-LS6.0-BL-EP]  25.06 35.83 270 top
U5  -  [SOT_224]  16.75 29.46 270 top
U6  PZ127-2-02-S  [HDR-SMD_4P-P1.27-V-M-R2-C2-LS5.3]  26.46 24.02 180 bottom
USB1  -  [USB-C-SMD_KH-TYPE-C-16P_1]  19.02 5.38 0 top

## Footprints (pads in the part's own frame, mm; a bottom-side part is the same pattern mirrored in y, then rotated)
C0603
  rect 0.8x0.9 smd: 1(-0.7,0) 2(0.7,0)
C0603_1
  rect 0.8x0.9 smd: 1(-0.7,0) 2(0.7,0)
C0603_2
  rect 0.8x0.9 smd: 1(-0.7,0) 2(0.7,0)
C0805
  rect 1.41x1.35 smd: 1(-1,0) 2(1,0)
C1206
  rect 1.485x1.728 smd: 1(-1.593,0) 2(1.593,0)
CAP-SMD_BD8.0-L8.3-W8.3-FD
  rect 4.2x1.4 smd: 1(-3.267,0) 2(3.267,0)
CAP-SMD_L3.2-W1.6-FD
  rect 1.2x1.5 smd: 1(-1.2,0) 2(1.2,0)
CONN-TH_2P-P2.50_HX25003-2WAP
  round 1.8 hole 1.1: 1(-1.25,0) 2(1.25,0)
HDR-SMD_4P-P1.27-V-M-R2-C2-LS5.3
  rect 0.74x2.4 smd: 1(-0.635,-1.95) 2(-0.635,1.95) 3(0.635,-1.95) 4(0.635,1.95)
HDR-TH_8P-P2.54-V-M
  rect 1.5x1.5 hole 1: 1(-8.89,0)
  round 1.5 hole 1: 2(-6.35,0) 3(-3.81,0) 4(-1.27,0) 5(1.27,0) 6(3.81,0) 7(6.35,0) 8(8.89,0)
IND-SMD_L7.3-W6.6
  rect 2.424x3.42 smd: 1(3.278,0) 2(-3.278,0)
KEY-SMD_4P-L4.5-W4.5-P3.00-LS6.8
  rect 1.5x0.9 smd: 1(-3,1.5) 2(-3,-1.5) 3(3,-1.5) 4(3,1.5)
LED_0603
  rect 0.8x0.8 smd: 1(-0.851,-0.01) 2(0.75,-0.005)
Pad_e1
  oval 5.08x2.54 smd: 1(0,0)
Pad_e2
  round 3.2 hole 2.286: 1(0,0)
Pad_e3
  round 3.2 hole 2.286: 1(0,0)
Pad_e4
  round 3.2 hole 2.286: 1(0,0)
Pad_e5
  round 3.2 hole 2.286: 1(0,0)
Pad_e17
  oval 5.08x2.54 smd: 1(0,0)
Pad_e68
  oval 4.064x1.27 smd far side: 1(0,0)
Pad_e69
  oval 4.064x1.27 smd far side: 1(0,0)
Pad_e70
  oval 4.064x1.27 smd far side: 1(0,0)
Pad_e72
  oval 4.064x1.27 smd far side: 1(0,0)
Pad_e220
  oval 4.064x1.27 smd far side: 1(0,0)
Pad_e221
  oval 4.064x1.27 smd far side: 1(0,0)
Pad_e222
  oval 4.064x1.27 smd far side: 1(0,0)
Pad_e223
  oval 4.064x1.27 smd far side: 1(0,0)
Pad_e307
  oval 4.064x1.016 smd far side: 1(0,0)
Pad_e308
  oval 4.064x1.016 smd far side: 1(0,0)
Pad_e309
  oval 4.064x1.016 smd far side: 1(0,0)
Pad_e310
  oval 4.064x1.016 smd far side: 1(0,0)
Pad_e311
  oval 4.064x1.016 smd far side: 1(0,0)
Pad_e312
  oval 4.064x1.016 smd far side: 1(0,0)
R0603
  rect 0.806x0.864 smd: 1(-0.753,0) 2(0.753,0)
R0603_1
  rect 0.806x0.864 smd: 1(-0.753,0) 2(0.753,0)
R2512
  rect 1.282x3.456 smd: 1(-3.067,0) 2(3.067,0)
S8050_SOT-23
  rect 1x0.8 smd: 1(1.15,-0.823) 2(1.15,1.077) 3(-1.15,0.127)
SOIC-8_L4.9-W3.9-P1.27-LS6.0-BL-EP
  oval 0.602x1.941 smd: 1(-1.905,-2.72) 2(-0.635,-2.72) 3(0.635,-2.72) 4(1.905,-2.72) 5(1.905,2.72) 6(0.635,2.72) 7(-0.635,2.72) 8(-1.905,2.72)
  rect 3.098x2.41 smd: 9(0,0)
SOP-16_L10.0-W3.9-P1.27-LS6.0-BL
  oval 0.56x1.745 smd: 1(-4.445,-2.873) 2(-3.175,-2.873) 3(-1.905,-2.873) 4(-0.635,-2.873) 5(0.635,-2.873) 6(1.905,-2.873) 7(3.175,-2.873) 8(4.445,-2.873) 9(4.445,2.873) 10(3.175,2.873) 11(1.905,2.873) 12(0.635,2.873) 13(-0.635,2.873) 14(-1.905,2.873) 15(-3.175,2.873) 16(-4.445,2.873)
SOT_224
  rect 1.1x2.2 smd: 1(-2.299,-3.126) 2(0,-3.126) 3(2.301,-3.126)
  rect 3.5x2.2 smd: 4(0,3.072)
SW-SMD_6P-L9.1-W3.5-P2.50-LS6.9
  rect 1.2x2 smd: 1(-2.5,-2.9) 2(0,-2.9) 3(2.5,-2.9) 4(2.5,2.9) 5(0,2.9) 6(-2.5,2.9)
TSOT-23-8_L2.9-W1.6-P0.65-LS2.8-BL
  rect 0.4x0.9 smd: 1(-0.975,-1.26) 2(-0.325,-1.26) 3(0.325,-1.26) 4(0.975,-1.26) 5(0.975,1.26) 6(0.325,1.26) 7(-0.325,1.26) 8(-0.975,1.26)
USB-C-SMD_KH-TYPE-C-16P_1
  oval 1.2x2 hole 0.7x1.7: 1(-4.32,1.765) 2(4.32,1.765)
  oval 1.2x1.8 hole 0.7x1.4: 3(-4.32,-2.415) 4(4.32,-2.415)
  rect 0.3x1.3 smd: A1(-3.35,2.415) A4(-2.55,2.415) A5(-1.25,2.415) A6(-0.25,2.415) A7(0.25,2.415) A8(1.25,2.415) A9(2.55,2.415) A12(3.35,2.415) B1(3.05,2.415) B4(2.25,2.415) B5(1.75,2.415) B6(0.75,2.415) B7(-0.75,2.415) B8(-1.75,2.415) B9(-2.25,2.415) B12(-3.05,2.415)
WIFI-SMD_ESP32-WROOM-32E_1
  rect 0.95x2.1 smd: 1(-9.002,-9) 2(-7.732,-9) 3(-6.463,-9) 4(-5.192,-9) 5(-3.922,-9) 6(-2.652,-9) 7(-1.383,-9) 8(-0.113,-9) 9(1.157,-9) 10(2.428,-9) 11(3.697,-9) 12(4.968,-9) 13(6.237,-9) 14(7.508,-9) 25(7.508,9) 26(6.237,9) 27(4.968,9) 28(3.697,9) 29(2.428,9) 30(1.157,9) 31(-0.113,9) 32(-1.383,9) 33(-2.652,9) 34(-3.922,9) 35(-5.192,9) 36(-6.463,9) 37(-7.732,9) 38(-9.002,9)
  rect 2.1x0.95 smd: 15(9.002,-5.715) 16(9.002,-4.445) 17(9.002,-3.175) 18(9.002,-1.905) 19(9.002,-0.635) 20(9.002,0.635) 21(9.002,1.905) 22(9.002,3.175) 23(9.002,4.445) 24(9.002,5.715)
  rect 0.9x0.9 smd: 39(-2.721,-0.1) 39(-2.721,-1.5) 39(-2.721,-2.9) 39(-1.321,-0.1) 39(-1.321,-1.5) 39(-1.321,-2.9) 39(0.079,-0.1) 39(0.079,-1.5) 39(0.079,-2.9)

## Nets
3V3: C4.2 C5.2 C19.1 C20.2 R1.2 R2.2 R3.2 R4.1 R5.2 R17.2 U2.2 U5.2 U5.4
5V: C1.1 C2.1 C12.2 C13.2 C14.2 C17.2 C18.2 H4.6 L1.2 NOREF#13.1 NOREF#17.1 R12.2 U1.16 U4.4 U5.3 U6.3 USB1.A4 USB1.A9 USB1.B4 USB1.B9
12V: C8.2 C9.2 C15.1 C16.2 R9.1 SW3.2 SW3.5 U3.2 U4.5
GND: C1.2 C2.2 C3.2 C4.1 C5.1 C6.1 C7.1 C8.1 C9.1 C11.2 C13.1 C14.1 C15.2 C16.1 C17.1 C18.1 C19.2 C20.1 CN1.1 H4.5 LED1.1 LED2.1 NOREF.1 NOREF#7.1 R13.2 R14.1 R15.2 SW1.1 SW1.2 SW2.1 SW2.2 U1.1 U2.1 U2.15 U2.38 U2.39 U3.4 U4.1 U4.9 U5.1 U6.4 USB1.1 USB1.2 USB1.3 USB1.4 USB1.A1 USB1.A12 USB1.B1 USB1.B12
VBAT: CN1.2 SW3.3 SW3.4
$C3_1: C3.1 U1.4
$C10_1: C10.1 R8.1
$C10_2: C10.2 L1.1 U3.3
$C11_1: C11.1 R10.2 U3.7
$C12_1: C12.1 R11.1 R12.1 R15.1
$LED1_2: LED1.2 R16.1
$LED2_2: LED2.2 R17.1
$Q1_1: Q1.1 R6.2
$Q2_1: Q2.1 R7.2
$R4_2: R4.2 U2.29
$R8_2: R8.2 U3.5
$R9_2: R9.2 U3.6
$R10_1: R10.1 R14.2 U3.1
$R11_2: R11.2 U3.8
$R13_1: R13.1 U4.7
DTR: Q2.2 R6.1 U1.13
EN: C7.2 Q1.3 R2.1 SW2.3 SW2.4 U2.3
IO0: C6.2 Q2.3 R1.1 SW1.3 SW1.4 U2.25
IO2: R16.2 U2.24
IO12: NOREF#4.1 U2.14
IO14: NOREF#16.1 U2.13
IO32: NOREF#14.1 U2.8
IO33: NOREF#6.1 U2.9
IO34: NOREF#18.1 U2.6
IO35: NOREF#8.1 U2.7
M1: NOREF#19.1 U4.6
M2: NOREF#12.1 U4.8
PWM1: U2.11 U4.3
PWM2: U2.12 U4.2
RTS: Q1.2 R7.1 U1.14
RXD0: U1.2 U2.34
RXD2: H4.4 NOREF#20.1 U2.27
SPK+: H4.8 U6.2
SPK-: H4.7 U6.1
SW1: NOREF#15.1 U2.31
SW2: NOREF#2.1 U2.30
TXD0: R3.1 U1.3 U2.35
TXD2: H4.3 NOREF#11.1 R5.1 U2.28
USB-D+: U1.5 USB1.A6 USB1.B6
USB-D-: U1.6 USB1.A7 USB1.B7

Pads without a net: H4 1 2; H5 1 2 3 4 5 6 7 8; NOREF#3 1; NOREF#5 1; NOREF#9 1; NOREF#10 1; SW3 1 6; U1 7 8 9 10 11 12 15; U2 4 5 10 16 17 18 19 20 21 22 23 26 32 33 36 37; USB1 A5 A8 B5 B8

## Via types
v1: diameter 0.61, hole 0.406, Top Layer to Bottom Layer, 225 vias
v2: diameter 0.61, hole 0.305, Top Layer to Bottom Layer, 31 vias
v3: diameter 0.406, hole 0.203, Top Layer to Bottom Layer, 37 vias

## Routing (per net, layer and track width the routed paths; a pad name or vN(x,y) marks a point on that pad's centre or on a via; arc(x,y) is an arc through that point)
3V3: length 61.1
  Top Layer w0.381: v2(38.43,61.59) 37.51,62.51 24.71,62.51 ; v2(15.72,63.54) 16.85,63.54 R2.2
  Top Layer w0.508: 11.77,63.47 R1.2
  Top Layer w0.61: 11.77,63.47 10.25,63.47 9.64,62.86 9.64,50.71 18.26,42.09 18.26,36.42 C19.1
  Bottom Layer w0.203: R5.2 37.53,51.1
  Bottom Layer w0.381: v1(21.03,27.59) 21.37,27.25 21.37,26.66 ; R17.2 21.37,26.66 ; 21.37,26.66 21.36,26.66 ; 37.53,51.1 R4.1 37.53,54.38 38.44,55.29 R3.2 38.44,61.58 v2(38.43,61.59)
  vias: v2(9.76,64.22) v2(9.76,63.44) v2(9.76,62.69) v2(10.54,64.22) v2(10.54,63.44) v2(10.54,62.69) v2(22.78,64.1) v2(22.78,63.43) v2(22.79,62.75) v2(23.47,62.76)
5V: length 88
  Top Layer w0.152: C12.2 13.49,24.71
  Top Layer w0.203: 13.49,24.71 R12.2
  Top Layer w0.254: 21.68,22.24 21.63,22.29 21.63,32.21 22.31,32.89 22.31,33.85 22.39,33.92
  Top Layer w0.305: C13.2 v3(4.23,10.18) ; v3(14.61,18.99) 14.61,22.87 14.31,23.17 R12.2
  Top Layer w0.381: 20.54,11.18 20.63,11.09 42.77,11.09 44.4,12.72 44.4,16.98 48.24,20.82 H4.6
  Bottom Layer w0.305: v3(14.61,18.99) 14.61,9.4 12.19,6.98 5.57,6.98 4.26,8.29 4.26,10.14 v3(4.23,10.18)
  vias: v1(6.8,4.1) v1(7.77,4.12) v1(8.74,4.14) v1(9.71,4.16) v1(10.68,4.18) v2(20.87,17.96) v2(20.87,17.29) v2(21.54,17.96) v2(21.54,17.29) v2(22.18,17.94) v2(22.18,17.27)
12V: length 44.2
  Top Layer w0.152: 6.39,24.75 v3(6.4,24.76)
  Top Layer w0.203: R9.1 6.39,24.75
  Bottom Layer w0.152: v3(6.4,24.76) 6.37,24.79
  Bottom Layer w0.203: 6.37,24.79 3.85,24.79
  Bottom Layer w0.508: v2(36.13,33.28) 36.12,33.27
  Bottom Layer w0.635: v1(2.09,28.17) 2.09,33.06 6.28,37.25 28.46,37.25 32.44,33.27 v2(34.72,33.27)
  vias: v1(1.14,27.18) v1(1.16,26.21) v1(1.18,25.24) v1(1.2,24.27) v1(1.22,23.3) v1(1.24,22.33) v1(2.11,27.2) v1(2.13,26.23) v1(2.15,25.26) v1(2.17,24.29) v1(2.19,23.32) v1(2.21,22.35) v1(3.06,28.19) v1(3.08,27.22) v1(3.1,26.25) v1(3.12,25.28) v1(3.14,24.31) v1(3.16,23.34) v1(3.18,22.37) v1(4.03,28.21) v1(4.05,27.24) v2(1.12,28.15) v2(35.36,33.27)
GND: length 3.1
  Top Layer w0.254: USB1.B12 USB1.A1 15.35,7.79 USB1.1 ; R13.2 v3(38.97,36.53)
  vias: v1(0.77,49.56) v1(0.77,48.41) v1(0.78,47.18) v1(0.78,46.03) v1(1.14,16.34) v1(1.14,15.19) v1(1.74,49.58) v1(1.74,48.43) v1(1.75,47.2) v1(1.75,46.05) v1(2.11,16.36) v1(2.11,15.21) v1(2.71,49.6) v1(2.71,48.45) v1(2.72,47.22) v1(2.72,46.07) v1(2.99,38.84) v1(2.99,37.69) v1(3.08,16.38) v1(3.08,15.23) v1(3.68,49.62) v1(3.68,48.47) v1(3.69,47.24) v1(3.69,46.09) v1(3.96,38.86) v1(3.96,37.71) v1(4.05,16.4) v1(4.05,15.25) v1(4.65,49.64) v1(4.65,48.49) v1(4.66,47.26) v1(4.66,46.11) v1(5.09,43.55) v1(5.09,42.4) v1(5.02,16.42) v1(5.02,15.27) v1(6.06,43.57) v1(6.06,42.42) v1(6.47,41.07) v1(6.47,39.92) v1(7.44,41.09) v1(7.44,39.94) v1(15.38,41.15) v1(15.38,40) v1(16.35,41.17) v1(16.35,40.02) v1(17.07,52.75) v1(17.09,51.78) v1(17.11,50.81) v1(17.13,49.84) v1(17.15,48.88) v1(17.13,47.93) v1(17.15,46.96) v1(17.17,45.99) v1(17.19,45.02) v1(18.22,52.75) v1(18.23,51.75) v1(18.26,50.81) v1(18.28,49.84) v1(18.3,48.88) v1(18.28,47.93) v1(18.3,46.96) v1(18.32,45.99) v1(18.34,45.02) v1(22.55,31.01) v1(22.55,29.86) v1(22.63,28.92) v1(22.63,27.77) v1(23.1,43.18) v1(23.1,42.03) v1(23.52,31.03) v1(23.52,29.88) v1(23.6,28.94) v1(23.6,27.79) v1(24.07,43.2) v1(24.07,42.05) v1(24.49,31.05) v1(24.49,29.9) v1(24.57,28.96) v1(24.57,27.81) v1(24.7,9.6) v1(24.7,8.36) v1(24.7,7.21) v1(25.04,43.22) v1(25.04,42.07) v1(25.46,31.07) v1(25.46,29.92) v1(25.54,28.98) v1(25.54,27.83) v1(25.67,9.62) v1(25.67,8.38) v1(25.67,7.23) v1(26.01,43.24) v1(26.01,42.09) v1(26.43,29.94) v1(26.51,29) v1(26.64,9.64) v1(26.64,8.4) v1(26.64,7.25) v1(26.98,43.26) v1(26.98,42.11) v1(27.61,9.66) v1(27.61,8.42) v1(27.61,7.27) v1(28.58,9.68) v1(28.58,8.44) v1(28.58,7.29) v1(28.85,43.29) v1(28.85,42.14) v1(29.82,43.31) v1(29.82,42.16) v1(30.79,43.33) v1(30.79,42.18) v1(31.38,9.63) v1(31.38,8.39) v1(31.38,7.24) v1(31.76,43.35) v1(31.76,42.2) v1(32.35,9.65) v1(32.35,8.41) v1(32.35,7.26) v1(32.73,43.37) v1(32.73,42.22) v1(33.32,9.67) v1(33.32,8.43) v1(33.32,7.28) v1(34.29,9.69) v1(34.29,8.45) v1(34.29,7.3) v1(35.26,9.71) v1(35.26,8.47) v1(35.26,7.32) v1(36.91,9.64) v1(36.91,8.49) v1(36.97,7.19) v1(37.88,9.66) v1(37.88,8.51) v1(37.94,7.21) v1(38.85,9.68) v1(38.85,8.53) v1(38.91,7.23) v1(39.82,9.7) v1(39.82,8.55) v1(39.88,7.25) v1(40.79,9.72) v1(40.79,8.57) v1(40.85,7.27) v1(42.09,24.95) v1(42.09,23.8) v1(42.05,22.37) v1(42.05,21.22) v1(43.06,24.97) v1(43.06,23.82) v1(43.02,22.39) v1(43.02,21.24) v1(43.99,22.41) v1(43.99,21.26) v1(44.03,24.99) v1(44.03,23.84) v1(45,25.01) v1(45,23.86) v1(44.96,22.43) v1(44.96,21.28) v1(45.97,25.03) v1(45.97,23.88) v1(45.93,22.45) v1(45.93,21.3) v1(50.9,25.61) v1(50.9,24.46) v1(50.9,23.31) v1(50.9,22.16) v1(50.82,20.81) v1(50.82,19.66) v1(51.79,20.83) v1(51.79,19.68) v1(51.87,25.63) v1(51.87,24.48) v1(51.87,23.33) v1(51.87,22.18) v1(52.76,20.85) v1(52.76,19.7) v1(52.84,25.65) v1(52.84,24.5) v1(52.84,23.35) v1(52.84,22.2) v1(53.73,20.87) v1(53.73,19.72) v1(53.81,25.67) v1(53.81,24.52) v1(53.81,23.37) v1(53.81,22.22) v1(54.78,25.69) v1(54.78,24.54) v1(54.78,23.39) v1(54.78,22.24) v1(54.7,20.89) v1(54.7,19.74) v2(13.69,22.26) v2(18.09,19.41) v2(18.09,18.74) v2(18.76,19.41) v2(18.76,18.74) v2(19.43,19.41) v2(19.43,18.74) v2(20.1,19.41) v2(20.1,18.74)
$C10_1: length 1.7
  Top Layer w0.152: C10.1 13.49,18.17
  Top Layer w0.203: 13.49,18.17 R8.1
$C11_1: length 10
  Top Layer w0.152: U3.7 9.92,20.71 v3(9.2,20.71)
  Top Layer w0.203: v3(7.91,26.32) R10.2 ; C11.1 11.98,21.39 11.34,21.39 10.66,20.7 U3.7
  Bottom Layer w0.152: v3(7.91,26.32) 7.91,26.29
  Bottom Layer w0.203: v3(9.2,20.71) 9.17,20.74 9.17,25.03 7.91,26.29
$C12_1: length 6.5
  Top Layer w0.152: 11.93,24.75 C12.1 ; R15.1 10.35,24.74 ; 11.97,23.18 R12.1
  Top Layer w0.203: 11.93,24.75 R15.1 ; 11.97,23.18 R11.1 10.35,24.74 ; R12.1 11.98,24.8
$LED1_2: length 1.7
  Top Layer w0.305: R16.1 37.87,42.65 LED1.2
$LED2_2: length 1.7
  Bottom Layer w0.305: 21.38,22.19 21.38,23.86 21.36,23.88
$Q1_1: length 1.9
  Top Layer w0.203: Q1.1 37.09,20.15 35.4,20.15
$Q2_1: length 3.5
  Top Layer w0.203: R7.2 35.3,15.53 35.48,15.71 37.06,15.71 37.21,15.86 Q2.1
$R4_2: length 3.7
  Top Layer w0.203: 42.68,52.35 40.22,52.35 v3(40.21,52.36)
  Bottom Layer w0.203: v3(40.21,52.36) 39.98,52.59 39.04,52.59
$R8_2: length 2.2
  Top Layer w0.203: U3.5 10.85,19.41 11.22,19.78 R8.2
$R9_2: length 8.4
  Top Layer w0.203: v3(7.89,24.75) R9.2 ; v3(10.7,20.06) 9.92,20.06
  Bottom Layer w0.152: v3(7.89,24.75) 7.89,21.01 8.84,20.06 10.69,20.06 v3(10.7,20.06)
$R10_1: length 7.7
  Top Layer w0.203: 7.4,21.36 6.75,21.36 5.69,22.41 R14.2 4.93,23.18 4.74,23.37 4.74,26.04 5.02,26.32 R10.1
$R11_2: length 2.7
  Top Layer w0.203: 9.92,21.36 9.15,21.36 8.85,21.65 R11.2
$R13_1: length 3
  Top Layer w0.203: 30.81,36.57 30.71,36.47 27.83,36.47
DTR: length 14.9
  Top Layer w0.203: Q2.2 v3(36.24,14.81) ; U1.13 27.55,19.31 28.24,18.61 35.29,18.61 R6.1 36.22,18.62 v3(36.22,18.62)
  Bottom Layer w0.203: v3(36.22,18.62) 36.24,18.6 v3(36.24,14.81)
EN: length 61.4
  Top Layer w0.203: SW2.4 16.25,60.28 16.84,60.87 16.84,62.02 18.46,62.02 18.57,62.13 18.57,60.97 19.25,60.29 SW2.3 22.19,59.95 23.48,61.24 24.68,61.24 ; v3(38.46,32.02) 38.45,32.01 38.45,21.71 39.54,20.62 39.54,19.35 ; v3(26.19,61.24) 24.71,61.24
  Bottom Layer w0.203: v3(38.46,32.02) 38.46,47.36 26.19,59.63 v3(26.19,61.24)
IO0: length 74.1
  Top Layer w0.203: v3(37.57,47.35) 37.65,47.27 42.71,47.27 ; SW1.3 14.12,60.23 13.51,60.84 C6.2 ; C6.2 14.48,62.01 v3(14.48,62.01) ; C6.2 13.5,61.99 11.8,61.99 11.8,60.92 11.12,60.24 SW1.4 ; Q2.3 39.43,15.76 38.35,16.84 38.35,21.01 37.85,21.51 37.85,33.38 v3(37.81,33.42)
  Bottom Layer w0.203: v3(14.48,62.01) 22.92,62.01 37.57,47.36 v3(37.57,47.35) 37.82,47.1 37.82,33.43 v3(37.81,33.42)
IO2: length 3.1
  Top Layer w0.305: 39.4,45.78 39.4,42.69
  Top Layer w0.381: 39.4,42.69 R16.2
IO12: length 3.5
  Top Layer w0.203: v3(23.38,47.25) U2.14
  Bottom Layer w0.203: v3(23.38,47.25) 21.2,47.25
IO14: length 3.5
  Top Layer w0.203: v3(23.38,48.52) U2.13
  Bottom Layer w0.203: 23.38,48.53 23.37,48.53 ; 23.37,48.53 NOREF#16.1 ; 23.37,48.53 v3(23.38,48.52)
IO32: length 3.6
  Top Layer w0.203: v3(23.32,54.93) 24.64,54.93 U2.8
  Bottom Layer w0.203: v3(23.32,54.93) NOREF#14.1
IO33: length 3.5
  Top Layer w0.203: v3(23.38,53.6) U2.9
  Bottom Layer w0.203: v3(23.38,53.6) 21.2,53.6
IO34: length 3.5
  Top Layer w0.254: 23.43,57.42 23.44,57.41 U2.6
  Bottom Layer w0.203: v3(23.38,57.41) 21.2,57.41
IO35: length 3.6
  Top Layer w0.203: v3(23.38,56.14) U2.7
  Bottom Layer w0.203: NOREF#8.1 23.34,56.18 v3(23.38,56.14)
M1: length 14.7
  Top Layer w0.381: U4.6 29.36,35.19 30.18,34.37 42.09,34.37 NOREF#19.1
M2: length 15.4
  Top Layer w0.381: U4.8 29.14,37.73 30.53,39.13 38.49,39.13 39.73,37.89 NOREF#12.1
PWM1: length 21.6
  Top Layer w0.203: 24.68,51.08 21.8,51.08 19.64,48.92 19.64,36.61 21.05,35.2 22.38,35.2 22.39,35.19
PWM2: length 18.9
  Top Layer w0.203: 24.68,49.81 24.65,49.84 21.4,49.84 20.18,48.62 20.18,37.26 20.98,36.47 22.39,36.47
RTS: length 15.1
  Top Layer w0.203: Q1.2 37.24,17.52 37.1,17.38 35.53,17.38 35.3,17.15 R7.1 34.04,16.42 32.36,18.1 27.49,18.1 26.28,19.31 U1.14
RXD0: length 57.9
  Top Layer w0.203: 42.68,58.7 42.67,58.69 40.67,58.69 39.19,57.21 39.19,48.4 39.2,48.41 v3(39.2,48.51) ; v3(25.01,16.13) 25.01,14.73 25.01,14.73
  Bottom Layer w0.203: v3(39.2,48.51) 40.08,47.63 40.08,23.57 32.64,16.13 v3(25.01,16.13)
RXD2: length 34.2
  Top Layer w0.203: 42.68,49.81 40.43,49.81 v3(40.06,49.45)
  Bottom Layer w0.203: H4.4 53.03,30.83 52.03,31.83 44.13,31.83 41.26,34.7 41.26,47.05 42.57,48.36 NOREF#20.1 v3(40.06,49.45)
SPK+: length 21.5
  Top Layer w0.305: H4.8 43.16,29.56 v3(39.07,25.47)
  Bottom Layer w0.305: v3(39.07,25.47) 39.03,25.47 36.27,22.71 31.34,22.71 28.13,25.92 27.13,25.92
SPK-: length 22.2
  Top Layer w0.305: v3(39.05,24.25) 39.12,24.25 H4.7
  Bottom Layer w0.305: 27.13,22.02 36.82,22.02 v3(39.05,24.25)
SW1: length 1.7
  Top Layer w0.203: v3(44.43,54.87) U2.31
SW2: length 1.6
  Top Layer w0.203: v3(44.27,53.59) 44.26,53.6 U2.30
TXD0: length 58.2
  Top Layer w0.203: v3(26.27,16.6) 26.27,14.73 U1.3 ; v3(38.71,48.11) 38.71,57.89 v3(39.95,59.13) 40.78,59.96 42.67,59.96
  Bottom Layer w0.203: R3.1 39.94,59.14 v3(39.95,59.13) ; v3(26.27,16.6) 32.38,16.6 39.53,23.75 39.53,47.29 v3(38.71,48.11)
TXD2: length 43.2
  Top Layer w0.203: v3(39.96,51.08) 42.68,51.08
  Bottom Layer w0.203: NOREF#11.1 40.17,51.3 v3(39.96,51.08) 39.96,51.08 39.02,51.08 38.99,51.05 38.99,49.51 40.65,47.85 40.65,34.22 41.73,33.14 41.73,30.43 42.55,29.61 54.64,29.61 H4.3
USB-D+: length 23.5
  Top Layer w0.152: v3(19.8,6.79) 19.77,6.82 USB1.B6 19.78,7.81 19.78,8.58 19.63,8.73 18.91,8.73 18.77,8.59 USB1.A6 ; v3(28.82,13.56) U1.5
  Bottom Layer w0.152: v3(19.8,6.79) 19.8,6.51 19.67,6.38 19.67,5.92 19.82,5.77 28.78,5.77 29.32,6.31 29.32,13.5 29.27,13.56 v3(28.82,13.56)
USB-D-: length 23.6
  Top Layer w0.152: v3(30.09,13.56) U1.6 ; USB1.A7 19.27,6.82 v3(19.24,6.79) 19.2,6.75 18.52,6.75 18.27,7 USB1.B7
  Bottom Layer w0.152: v3(19.24,6.79) 19.24,6.51 19.37,6.38 19.37,5.79 19.69,5.47 28.91,5.47 29.62,6.18 29.62,13.5 29.68,13.56 v3(30.09,13.56)

## Copper pours and planes (outline as drawn; the poured copper is in the pictures)
3V3 on Top Layer: 16.77,30.32 17.23,30.78 17.23,37.04 17.44,37.25 19.02,37.25 19.28,36.99 19.28,32.37 19.44,32.21 20.96,32.21 21.19,31.98 21.19,27.4 20.71,26.92 17.54,26.92 17.17,27.29 17.17,28.12 16.79,28.5 12.3,28.5 12.06,28.74 12.06,30.09 12.29,30.32
3V3 on Top Layer: 21.61,64.41 23.17,64.41 23.53,64.04 23.53,63.25 23.66,63.12 25.76,63.12 25.88,63 25.88,62.01 25.76,61.89 23.1,61.89 22.92,61.71 22.92,61.31 22.57,60.96 21.58,60.96 21.39,61.15 21.39,64.19
3V3 on Top Layer: 9.48,64.66 12.39,64.66 12.56,64.49 12.56,62.83 12.37,62.64 11.25,62.64 11.01,62.4 9.55,62.4 9.32,62.63 9.32,64.5
3V3 on Bottom Layer: 23.4,64.49 23.7,64.18 23.7,62.52 23.47,62.29 9.85,62.29 9.32,62.81 9.32,64.23 9.58,64.49
5V on Top Layer: 16.72,28.09 16.9,27.91 16.9,18.85 17.49,18.26 20.45,18.26 21.11,18.92 21.11,22.78 21.28,22.94 22.39,22.94 22.41,22.93 22.47,22.93 22.62,22.78 22.62,10.7 21.41,9.49 14.4,9.49 13.56,10.33 13.33,10.33 13.33,15.84 13.65,16.16 15.17,16.16 15.17,23.26 14.49,23.94 14.49,25.64 14.37,25.76 12.36,25.76 12.21,25.91 12.21,27.98 12.32,28.09
5V on Top Layer: 0.84,12.42 5.27,12.42 5.37,12.32 5.37,10.91 5.49,10.79 15.92,10.79 16.43,11.3 16.43,16.63 16.6,16.8 17.8,16.8 17.95,16.65 17.95,13.51 18.17,13.29 21.62,13.29 21.8,13.11 21.8,3.96 21.45,3.61 4.04,3.61 3.65,4 3.65,7.22 3.09,7.78 1,7.78 0.59,8.19 0.59,12.18 0.84,12.43
5V on Top Layer: 23.23,19.55 24.13,19.55 24.26,19.68 24.26,22.84 24.06,23.04 21.84,23.04 21.68,22.89 21.68,21.8 21.87,21.62 23.06,21.62 23.19,21.49 23.19,19.59
5V on Bottom Layer: 4.39,6 12.97,6 13.53,5.44 13.53,4.12 13.15,3.74 4.21,3.74 4,3.95 4,5.63 4.38,6.01
5V on Bottom Layer: 26.23,23.51 26.44,23.3 26.44,17.46 25.89,16.91 20.7,16.91 20.5,17.11 20.5,18.16 20.68,18.34 24.74,18.34 25.24,18.84 25.24,23.32 25.43,23.51
12V on Top Layer: 36.15,34.3 36.47,33.98 36.47,32.99 36.21,32.73 34.63,32.73 34.47,32.57 34.47,29.48 34.3,29.31 32.71,29.31 32.54,29.48 32.54,32.39 32.42,32.51 28.58,32.51 28.47,32.4 28.44,32.4 28.44,31.6 28.13,31.29 27.33,31.29 27.15,31.47 27.15,33.37 26.81,33.71 26.81,34.15 26.96,34.3
12V on Top Layer: 0.82,20.12 6.21,20.12 6.58,20.49 7.9,20.49 7.96,20.55 7.96,20.94 7.89,21.01 6.55,21.01 6.13,21.43 6.13,21.44 5.25,22.32 4.64,22.32 4.13,22.83 4.13,26.41 5.02,27.3 5.02,28.57 4.7,28.89 1.08,28.89 0.51,28.32 0.51,20.43
12V on Bottom Layer: 14.33,20.01 15.87,20.01 16.05,20.19 16.05,28.58 15.74,28.89 1.08,28.89 0.41,28.22 0.41,20.32 0.66,20.07 4.45,20.07 4.86,20.48 4.86,26.73 5.48,27.35 10.9,27.35 11.65,26.6 11.65,25.87 12,25.53 14.09,25.53 14.2,25.41 14.21,25.41 14.21,20.13
12V on Bottom Layer: 33.85,33.93 36.32,33.93 36.5,33.75 36.5,32.86 36.28,32.64 34.24,32.64 33.74,33.14 33.74,33.84 33.84,33.94
GND on Top Layer: 6.69,19.76 6.78,19.67 7.91,19.67 7.99,19.59 7.99,18.58 6.72,17.31 6.72,15.21 5.79,15.21 5.35,14.77 5.35,12.97 5.23,12.85 0.73,12.85 0.55,13.03 0.55,19.64 0.67,19.76
GND on Top Layer: -2.3,66.37 64.25,66.37 64.25,-1.68 -2.3,-1.68
GND on Bottom Layer: -2.3,66.37 64.25,66.37 64.25,-1.68 -2.3,-1.68
VBAT on Bottom Layer: 19.19,32.75 19.99,31.95 19.99,20.55 19.43,19.99 17.03,19.99 16.56,20.46 16.56,29.42 16.16,29.82 5.99,29.82 5.67,30.14 5.67,32.37 6.05,32.75
$C3_1 on Top Layer: 27.08,15.8 27.99,15.8 28.13,15.66 28.13,11.92 28,11.78 27.1,11.78 26.92,11.96 26.92,15.64
$C10_2 on Top Layer: 6.91,20.34 9.07,20.34 9.14,20.27 9.14,19.02 9.32,18.84 12.26,18.84 12.59,18.51 12.59,15.11 12.38,14.9 7.31,14.9 7.02,15.19 7.02,17.48 8.04,18.5 8.04,19.71 7.95,19.8 6.92,19.8 6.87,19.85 6.87,20.3

Small or netless copper shapes (teardrops, artwork), in the pictures only: 1 on Top Layer

## Text on the board
Bottom Silkscreen Layer: 5V | GND | IO34 | IO35 | IO32 | IO33 | IO12 | IO14 | IO19 | IO18 | T2 | R2 | NC | 12V | C- | C+ | S- | S+
Top Solder Mask Layer: Designed / by ZHP
Top Silkscreen Layer: JLCJLCJLCJLC | IO0 | RST | S+ | S- | 5V | G | TX | RX | M2 | M1 | 12V | GND | USB | 经理:单如帅  文秘:刘潇繁 / 财务:张昂    市场:张颖霖 / 质控:白棣    齐元森 / 开发:张浩鹏 王丹 赵鹏飞 陶祥
